# Altium schematic sheet BSE_SCH.SchDoc
size A; DocumentNumber: 1; SheetNumber: 1; SheetTotal: 1
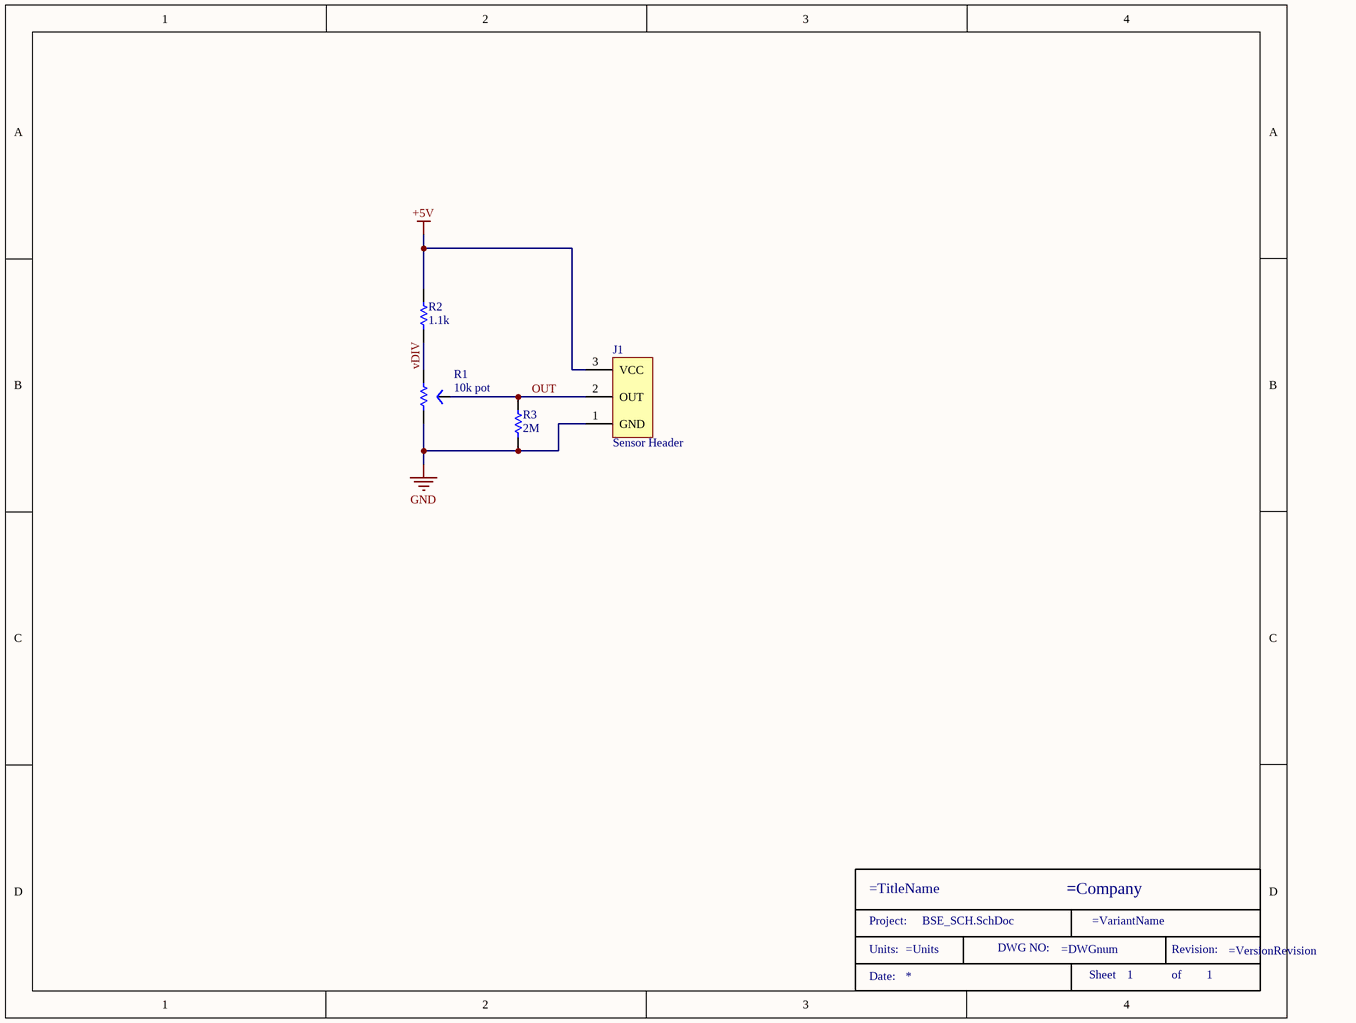
[diagram p0: BSE_SCH.SchDoc]

## Parts
*  TitleBlock  (value not drawn)  (graphical)
J1  Sensor Header  [3PIN]
R1  10k pot  [10k Rotary Encoder]
R2  1.1k  [RES 0603]
R3  2M  [RES 0603]

## Nets
+5V: J1.3(VCC) R2.2
GND: J1.1(GND) R1.1 R3.1
OUT: J1.2(OUT) R1.2 R3.2
vDIV: R1.3 R2.1

## Notes on the sheet
- (in symbol TitleBlock) Project:; Units:; DWG NO:; Revision:; Date:; Sheet; of

## Library data of the parts
* = TitleBlock: TItle Block
J1 = 3PIN: CONN HEADER R/A 3POS 2.54MM; Manufacturer: Molex; Manufacturer Part Number: 70553-0002; Gender: Male; Number of Positions: 3; Contact Resistance: 30mR; Current Rating: 3A; Voltage Rating: 250V; Insulation Resistance: 1GR; Approvals: UL,CSA; Glow Wire Compliant: Non-compliant; Supplier 1: Digi-Key; Stock 1: 2903; Pricing 1: 1=1.02, 10=0.893, 100=0.7702, 500=0.63018, 1000=0.56016, 5000=0.49014, 10000=0.46563 (USD); Mount: Through Hole; Housing Color: Black; Housing Material: Thermoplastic; Color: Black; Contact Plating: Gold; Contact Material: Bronze,Brass,Copper Alloy; Material: Brass; Min Operating Temperature: -40°C; Max Operating Temperature: 105°C; Packaging: Rail/Tube; Termination: Solder; Orientation: Right Angle; Number of Rows: 1; Package Quantity: 2080; Number of Contacts: 3; Contact Gender: Male; Number of Circuits: 3; Voltage Rating (DC): 250V; Pitch: 2.54mm; Radiation Hardening: No; Lead Free: Lead Free; REACH SVHC: Unknown; ELV: Compliant; Flammability Rating: UL94 V-0; ComponentLink1URL: http://www.molex.com/webdocs/datasheets/pdf/en-us/0705530002_PCB_HEADERS.pdf?src-supplier=Avnet; ComponentLink1Description: http://www.molex.com/webdocs/datasheets/pdf/en-us/0705530002_PCB_HEADERS.pdf?src-supplier=Avnet; ComponentLink2URL: http://www.onlinecomponents.com/productFiles/mf-MOL/209530705530002_pcb_headers.pdf?src-supplier=Onlinecomponents.com; ComponentLink2Description: http://www.onlinecomponents.com/productFiles/mf-MOL/209530705530002_pcb_headers.pdf?src-supplier=Onlinecomponents.com; ComponentLink3URL: http://uk.rs-online.com/webdocs/1362/0900766b81362e0f.pdf?src-supplier=RSComponents; ComponentLink3Description: http://uk.rs-online.com/webdocs/1362/0900766b81362e0f.pdf?src-supplier=RSComponents; ComponentLink4URL: http://www.jameco.com/Jameco/Products/ProdDS/1933671.pdf?src-supplier=Jameco; ComponentLink4Description: http://www.jameco.com/Jameco/Products/ProdDS/1933671.pdf?src-supplier=Jameco; ComponentLink5URL: http://www.mouser.com/ds/2/276/0705530002_PCB_HEADERS-172778.pdf?src-supplier=Mouser; ComponentLink5Description: http://www.mouser.com/ds/2/276/0705530002_PCB_HEADERS-172778.pdf?src-supplier=Mouser; Supplier Part Number 1: WM4901-ND
R1 = 10k rotary encoder: Res Cermet Trimmer 10K Ohm 30% 1(Elec)/1(Mech)Turn 4mm (11 X 14.9 X 3.1mm) Gull Wing SMD T/R; Manufacturer: Murata; Manufacturer Part Number: SV01A103AEA01R00; Resistance: 10kR; Number of Turns: 1; Linearity: 2%; Temperature Coefficient: 500ppm/°C; Sensing Method: Resistive; Actuator Type: Hole for Shaft; Supplier 1: Digi-Key; Stock 1: 998; Pricing 1: 1=2.46, 5=2.328, 10=1.995, 25=1.596, 50=1.4628, 100=1.3299, 500=1.16366 (USD); Mount: Surface Mount; Case/Package: SMD/SMT; Min Operating Temperature: -40°C; Max Operating Temperature: 85°C; Packaging: Tape and Reel; Package Quantity: 1000; Tolerance: 30%; Termination: Gull Wing; Military Standard: Not; Type: Potentiometer; Length: 11mm; Height: 2.1mm; Depth: 14.9mm; Lead Free: Lead Free; ComponentLink1URL: http://www1.futureelectronics.com/doc/MURATA/SV01A103AEA01R00.pdf?src-supplier=Future+Electronics; ComponentLink1Description: http://www1.futureelectronics.com/doc/MURATA/SV01A103AEA01R00.pdf?src-supplier=Future+Electronics; ComponentLink2URL: https://www.murata.com/en-us/products/productdata/8796781117470/S0070E.pdf?src-supplier=Digi-Key; ComponentLink2Description: https://www.murata.com/en-us/products/productdata/8796781117470/S0070E.pdf?src-supplier=Digi-Key; ComponentLink3URL: http://www.murata.com/~/media/webrenewal/support/library/catalog/products/sensor/rotaryposition/r51e.ashx?src-supplier=Digi-Key; ComponentLink3Description: http://www.murata.com/~/media/webrenewal/support/library/catalog/products/sensor/rotaryposition/r51e.ashx?src-supplier=Digi-Key; ComponentLink4URL: http://uk.rs-online.com/webdocs/13ec/0900766b813ecb07.pdf?src-supplier=RSComponents; ComponentLink4Description: http://uk.rs-online.com/webdocs/13ec/0900766b813ecb07.pdf?src-supplier=RSComponents; Supplier Part Number 1: 490-7023-1-ND
R2 = RES 1.1k: ERJPA3 Resistors 0.25W 0603 1K1 1%; Manufacturer: Panasonic; Manufacturer Part Number: ERJ-PA3F1101V; Resistance: 1.1kR; Power Rating: 250mW; Voltage Rating: 150V; Temperature Coefficient: 100ppm/°C; Supplier 1: Digi-Key; Stock 1: 10551; Pricing 1: 1=0.13, 10=0.12, 100=0.0461, 1000=0.02028, 2500=0.01752 (USD); Mount: Surface Mount; Case/Package: 0603; Case Code (Metric): 1608; Case Code (Imperial): 0603; Min Operating Temperature: -55°C; Max Operating Temperature: 155°C; Tolerance: 1%; Packaging: Cut Tape; Composition: Thick Film; Number of Terminations: 2; Termination: Solder; Max Power Dissipation: 250mW; Voltage Rating (DC): 150V; Features: Automotive AEC-Q200; Length: 0.063inch; Height: 0.018inch; Width: 0.031inch; Depth: 0.8mm; REACH SVHC: No SVHC; ComponentLink1URL: http://www.farnell.com/datasheets/1801181.pdf?src-supplier=Element14; ComponentLink1Description: http://www.farnell.com/datasheets/1801181.pdf?src-supplier=Element14; ComponentLink2URL: http://industrial.panasonic.com/cdbs/www-data/pdf/RDO0000/AOA0000C331.pdf?src-supplier=Farnell; ComponentLink2Description: http://industrial.panasonic.com/cdbs/www-data/pdf/RDO0000/AOA0000C331.pdf?src-supplier=Farnell; Supplier Part Number 1: P1.1KBYCT-ND
R3 = RES 2M: Res Thick Film 0603 2MegaOhm 1% 1/4W ±100ppm/K Molded Paper T/R; Manufacturer: Vishay; Manufacturer Part Number: RCS06032M00FKEA; Supplier 1: Digi-Key; Stock 1: 5000; Pricing 1: 1=0.14, 10=0.123, 100=0.0472, 1000=0.02075, 2500=0.01792 (USD); Supplier Part Number 1: 541-RCS06032M00FKEACT-ND